# EAGLE design WaveformMorpher (EAGLE 8.3.1)

## Sheet 1 of 3
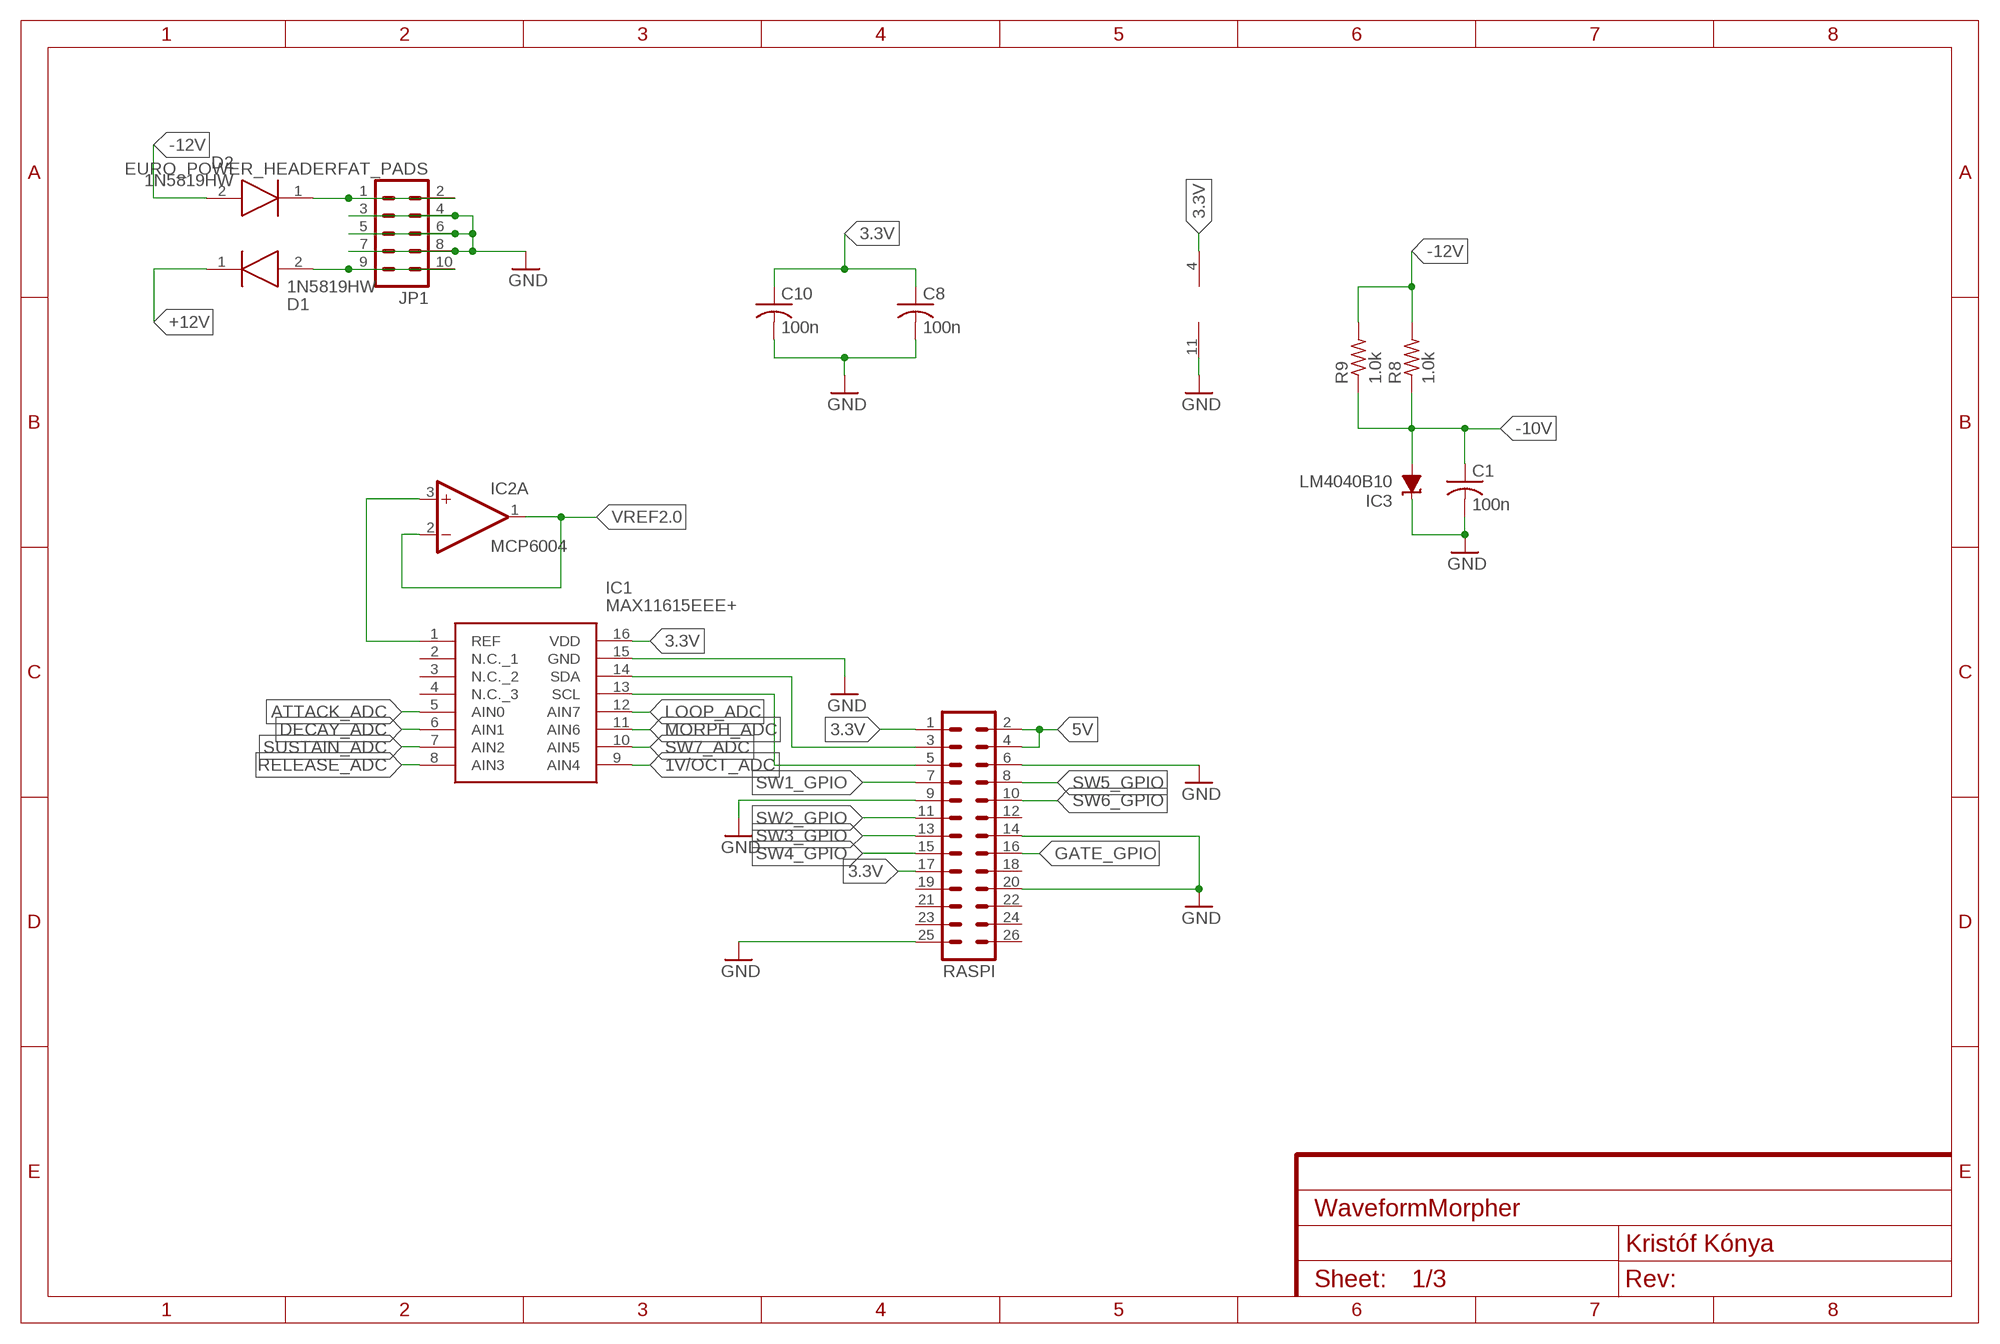
[diagram p0: schematic, sheet 1]
FRAME2 (FRAME-A4L): CNAME: POWER/DAC/CON; CREVISION: 0.7; DESIGNER: Kristóf Kónya; REV: 0.7

### Parts
C1  100n  C-USC0603  [C0603]
C8  100n  C-USC0603  [C0603]
C10  100n  C-USC0603  [C0603]
D1  1N5819HW  [SOD3716X145N]
D2  1N5819HW  [SOD3716X145N]
IC1  MAX11615EEE+  [SOP64P602X175-16N]
IC2  MCP6004  TL074D  [SO14]
IC3  LM4040B10  LM4041B12DBZ  [DBZ_R-PDSO-G3]
JP1  EURO_POWER_HEADERFAT_PADS  [EURO_PWR_HEADER_FAT]
R8  1.0k  R-US_R0603  [R0603]
R9  1.0k  R-US_R0603  [R0603]
RASPI  MA13-2  [MA13-2]

### Nets
1V/OCT_ADC: IC1.9(AIN4) ; also sheet 2
3.3V: C8.1 C10.1 IC1.16(VDD) IC2.4(P:V+) RASPI.1 RASPI.17 ; also sheet 2,3
5V: RASPI.2 RASPI.4 ; also sheet 2
+12V: D1.1(K) ; also sheet 2
-10V: C1.1 IC3.2(A) R8.1 R9.1 ; also sheet 2
-12V: D2.2(A) R8.2 R9.2 ; also sheet 2
ATTACK_ADC: IC1.5(AIN0) ; also sheet 3
DECAY_ADC: IC1.6(AIN1) ; also sheet 3
GATE_GPIO: RASPI.16 ; also sheet 2
GND: C1.2 C8.2 C10.2 IC1.15(GND) IC2.11(P:V-) IC3.1(C) JP1.3 JP1.4 JP1.5 JP1.6 JP1.7 JP1.8 RASPI.6 RASPI.9 RASPI.14 RASPI.20 RASPI.25 ; also sheet 2,3
LOOP_ADC: IC1.12(AIN7) ; also sheet 2
MORPH_ADC: IC1.11(AIN6) ; also sheet 2
N$1: IC1.14(SDA) RASPI.3
N$3: IC1.1(REF) IC2.3(A:+IN)
N$4: IC1.13(SCL) RASPI.5
N$7: D2.1(K) JP1.1 JP1.2
N$11: D1.2(A) JP1.9 JP1.10
RELEASE_ADC: IC1.8(AIN3) ; also sheet 3
SUSTAIN_ADC: IC1.7(AIN2) ; also sheet 3
SW1_GPIO: RASPI.7 ; also sheet 3
SW2_GPIO: RASPI.11 ; also sheet 3
SW3_GPIO: RASPI.13 ; also sheet 3
SW4_GPIO: RASPI.15 ; also sheet 3
SW5_GPIO: RASPI.8 ; also sheet 3
SW6_GPIO: RASPI.10 ; also sheet 3
SW7_ADC: IC1.10(AIN5) ; also sheet 3
VREF2.0: IC2.1(A:OUT) IC2.2(A:-IN) ; also sheet 2,3
Unconnected: IC1.2(N.C._1) IC1.3(N.C._2) IC1.4(N.C._3) RASPI.12 RASPI.18 RASPI.19 RASPI.21 RASPI.22 RASPI.23 RASPI.24 RASPI.26

## Sheet 2 of 3
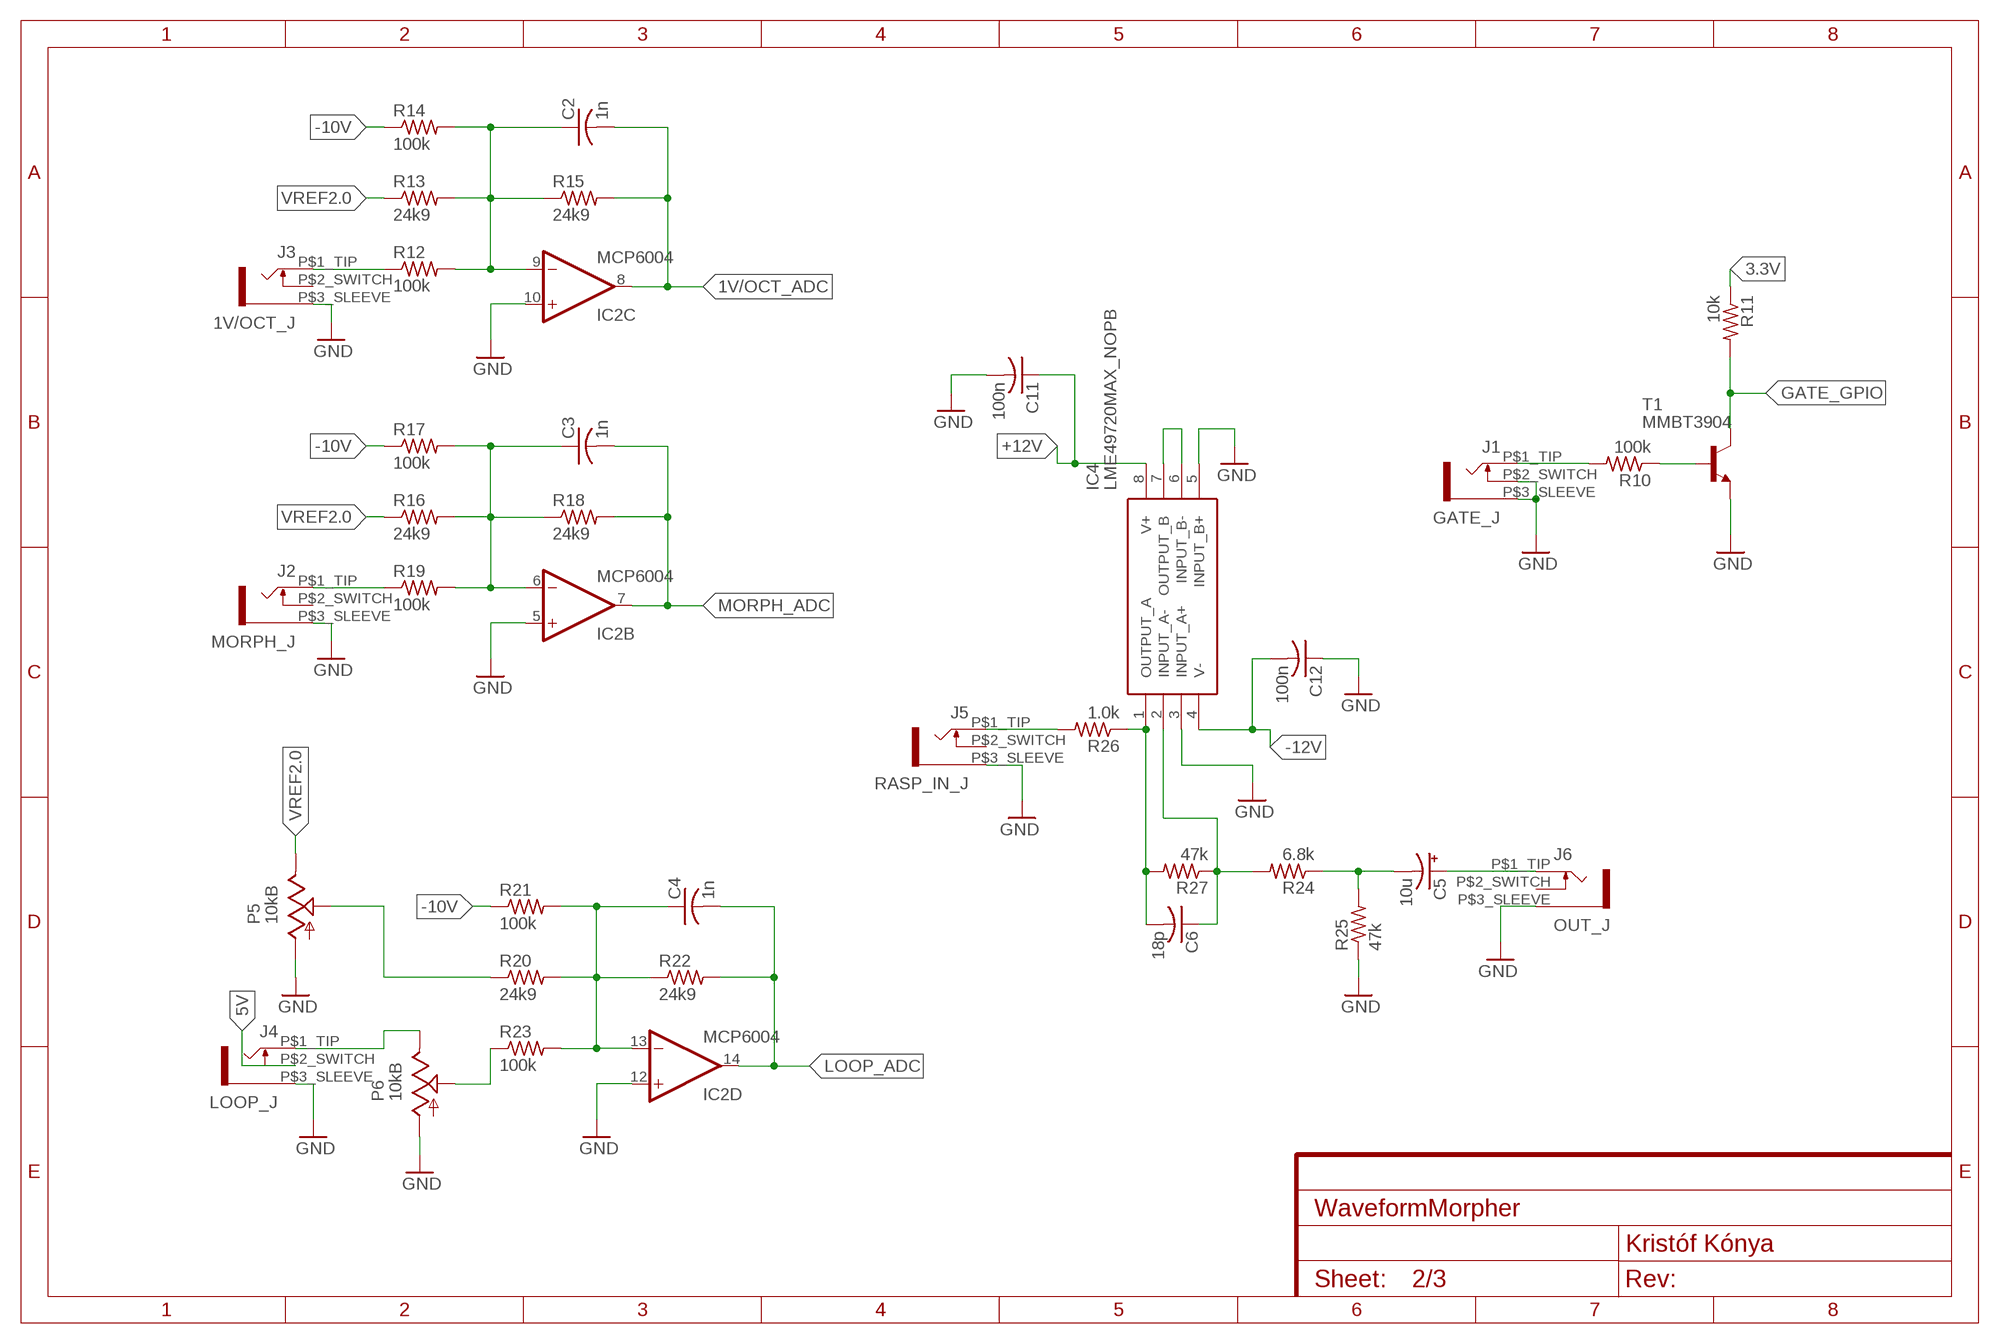
[diagram p1: schematic, sheet 2]
I/O (FRAME-A4L): CNAME: I/O; CREVISION: 0.7; DESIGNER: Kristóf Kónya; REV: 0.7

### Parts
C2  1n  C-USC0603  [C0603]
C3  1n  C-USC0603  [C0603]
C4  1n  C-USC0603  [C0603]
C5  10u  CPOL-USB  [PANASONIC_B]
C6  18p  C-USC0603  [C0603]
C11  100n  C-USC0603  [C0603]
C12  100n  C-USC0603  [C0603]
IC4  LME49720MAX_NOPB  [SOIC127P600X175-8N]
J1  GATE_J  WQP-PJ301M-12_JACK  [WQP-PJ301M-12_JACK]
J2  MORPH_J  WQP-PJ301M-12_JACK  [WQP-PJ301M-12_JACK]
J3  1V/OCT_J  WQP-PJ301M-12_JACK  [WQP-PJ301M-12_JACK]
J4  LOOP_J  WQP-PJ301M-12_JACK  [WQP-PJ301M-12_JACK]
J5  RASP_IN_J  WQP-PJ301M-12_JACK  [WQP-PJ301M-12_JACK]
J6  OUT_J  WQP-PJ301M-12_JACK  [WQP-PJ301M-12_JACK]
P5  10kB  9MM_SNAP-IN_POT_  [9MM_SNAP-IN_POT]
P6  10kB  9MM_SNAP-IN_POT_  [9MM_SNAP-IN_POT]
R10  100k  R-US_R0603  [R0603]
R11  10k  R-US_R0603  [R0603]
R12  100k  R-US_R0603  [R0603]
R13  24k9  R-US_R0603  [R0603]
R14  100k  R-US_R0603  [R0603]
R15  24k9  R-US_R0603  [R0603]
R16  24k9  R-US_R0603  [R0603]
R17  100k  R-US_R0603  [R0603]
R18  24k9  R-US_R0603  [R0603]
R19  100k  R-US_R0603  [R0603]
R20  24k9  R-US_R0603  [R0603]
R21  100k  R-US_R0603  [R0603]
R22  24k9  R-US_R0603  [R0603]
R23  100k  R-US_R0603  [R0603]
R24  6.8k  R-US_R0603  [R0603]
R25  47k  R-US_R0603  [R0603]
R26  1.0k  R-US_R0603  [R0603]
R27  47k  R-US_R0603  [R0603]
T1  MMBT3904  MMBT3904LT1-NPN-SOT23-BEC  [SOT23-BEC]

### Nets
1V/OCT_ADC: C2.2 IC2.8(C:OUT) R15.2 ; also sheet 1
3.3V: R11.1 ; also sheet 1,3
5V: J4.P$2_SWITCH ; also sheet 1
+12V: C11.1 IC4.8(V+) ; also sheet 1
-10V: R14.1 R17.1 R21.1 ; also sheet 1
-12V: C12.2 IC4.4(V-) ; also sheet 1
GATE_GPIO: R11.2 T1.C ; also sheet 1
GND: C11.2 C12.1 IC2.5(B:+IN) IC2.10(C:+IN) IC2.12(D:+IN) IC4.3(INPUT_A+) IC4.5(INPUT_B+) J1.P$2_SWITCH J1.P$3_SLEEVE J2.P$3_SLEEVE J3.P$3_SLEEVE J4.P$3_SLEEVE J5.P$3_SLEEVE J6.P$3_SLEEVE P5.1(A) P6.1(A) R25.1 T1.E ; also sheet 1,3
LOOP_ADC: C4.2 IC2.14(D:OUT) R22.2 ; also sheet 1
MORPH_ADC: C3.2 IC2.7(B:OUT) R18.2 ; also sheet 1
N$5: J1.P$1_TIP R10.2
N$6: R10.1 T1.B
N$8: J2.P$1_TIP R19.1
N$9: C2.1 IC2.9(C:-IN) R12.2 R13.2 R14.2 R15.1
N$10: C3.1 IC2.6(B:-IN) R16.2 R17.2 R18.1 R19.2
N$12: J3.P$1_TIP R12.1
N$14: C4.1 IC2.13(D:-IN) R20.2 R21.2 R22.1 R23.2
N$16: J4.P$1_TIP P6.3(E)
N$17: IC4.6(INPUT_B-) IC4.7(OUTPUT_B)
N$18: C6.2 IC4.1(OUTPUT_A) R26.1 R27.2
N$19: J5.P$1_TIP R26.2
N$20: C5.+ J6.P$1_TIP
N$21: C5.- R24.1 R25.2
N$22: P5.2(S) R20.1
N$23: C6.1 IC4.2(INPUT_A-) R24.2 R27.1
N$24: P6.2(S) R23.1
VREF2.0: P5.3(E) R13.1 R16.1 ; also sheet 1,3
Unconnected: J2.P$2_SWITCH J3.P$2_SWITCH J5.P$2_SWITCH J6.P$2_SWITCH

## Sheet 3 of 3
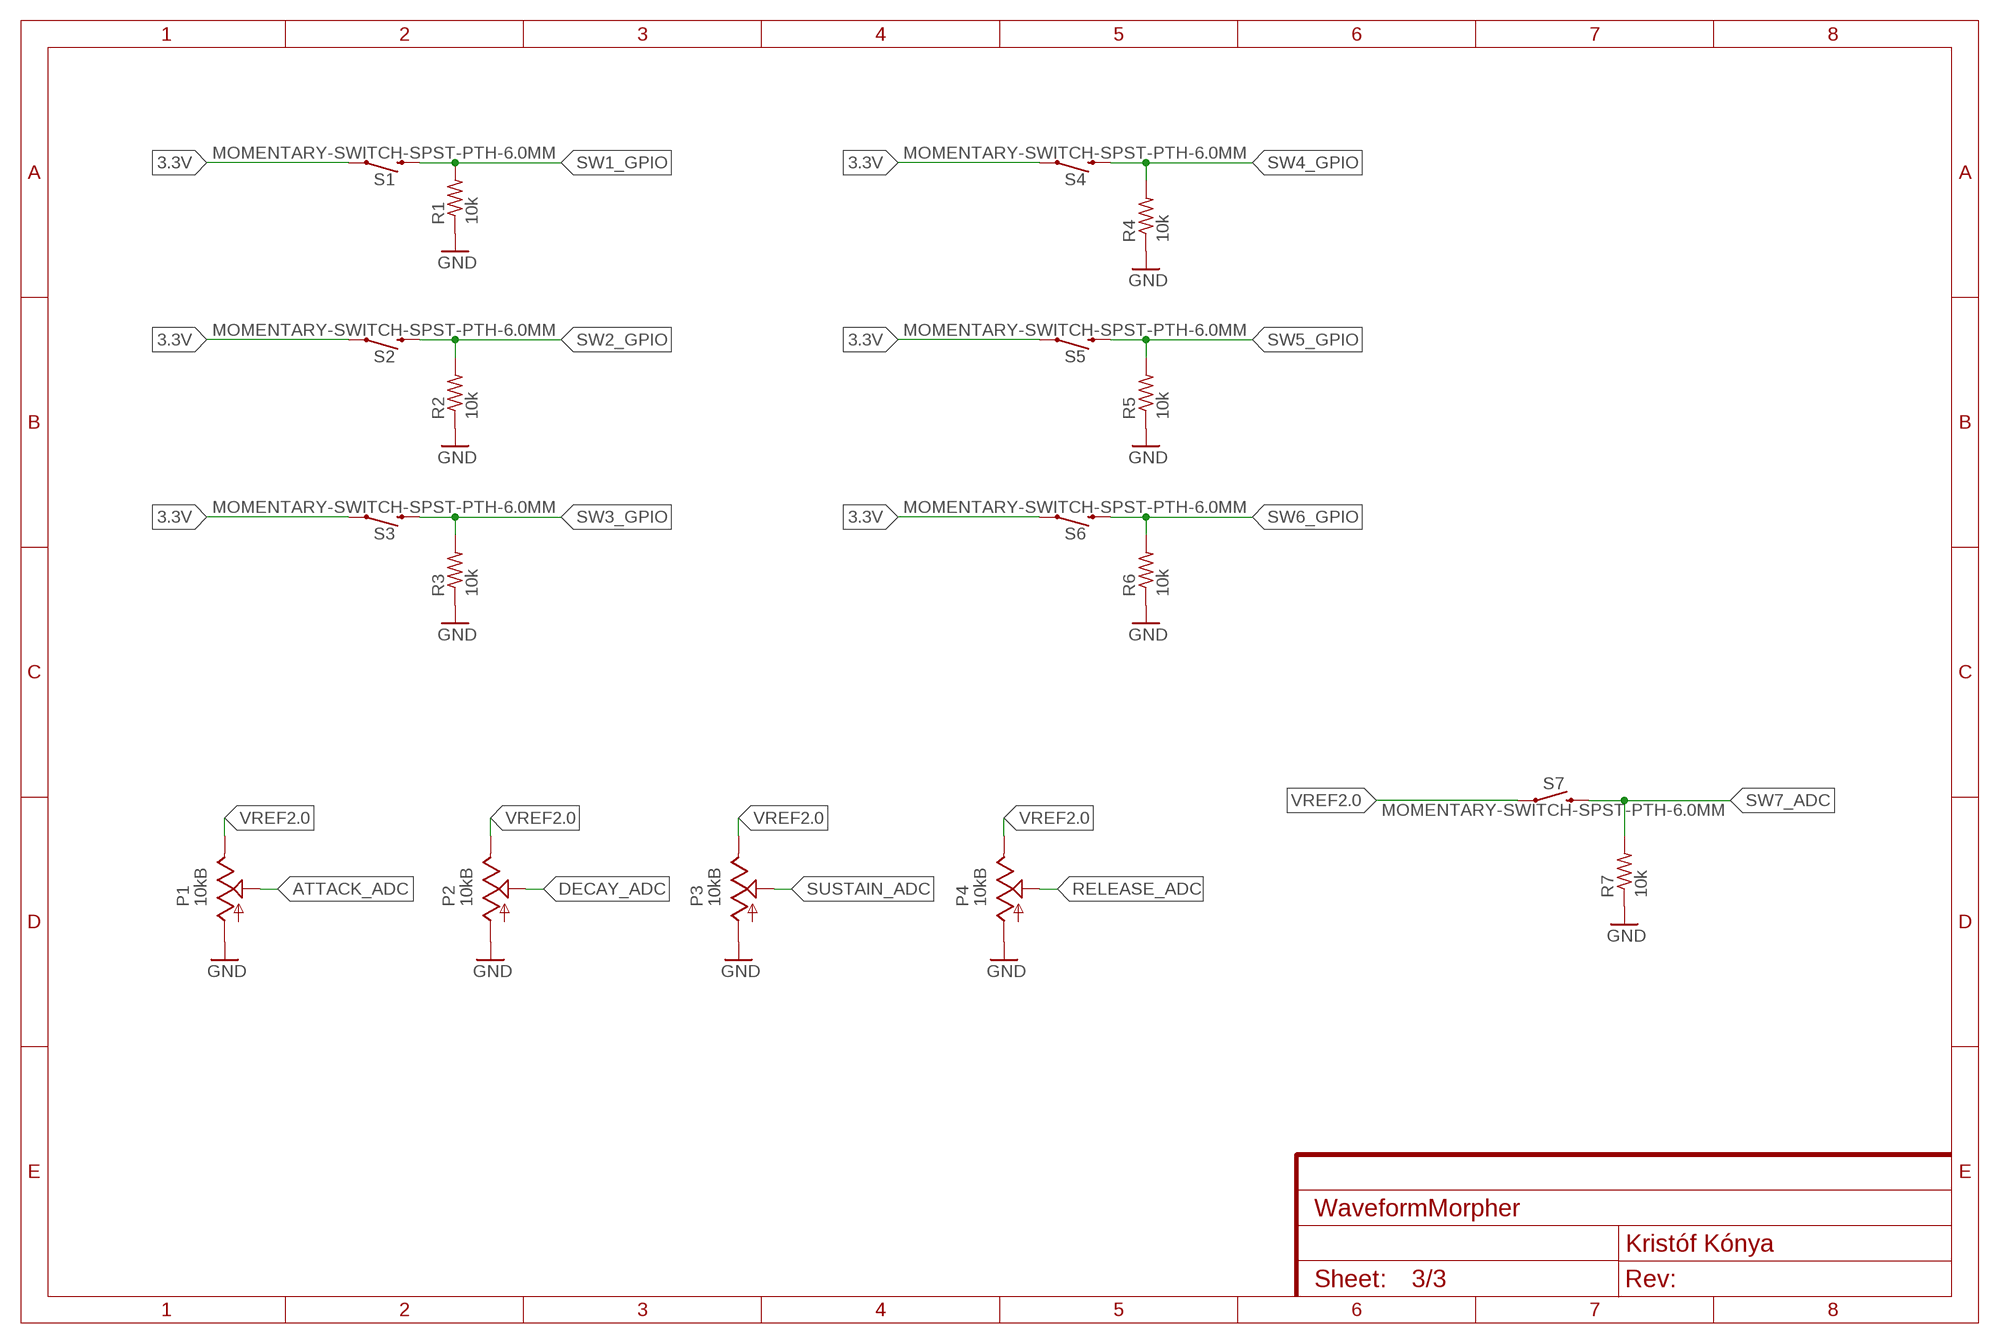
[diagram p2: schematic, sheet 3]
FRAME3 (FRAME-A4L): CNAME: SWITCHES/POTS; CREVISION: 0.7; DESIGNER: Kristóf Kónya; REV: 0.7

### Parts
P1  10kB  9MM_SNAP-IN_POT_  [9MM_SNAP-IN_POT]
P2  10kB  9MM_SNAP-IN_POT_  [9MM_SNAP-IN_POT]
P3  10kB  9MM_SNAP-IN_POT_  [9MM_SNAP-IN_POT]
P4  10kB  9MM_SNAP-IN_POT_  [9MM_SNAP-IN_POT]
R1  10k  R-US_R0603  [R0603]
R2  10k  R-US_R0603  [R0603]
R3  10k  R-US_R0603  [R0603]
R4  10k  R-US_R0603  [R0603]
R5  10k  R-US_R0603  [R0603]
R6  10k  R-US_R0603  [R0603]
R7  10k  R-US_R0603  [R0603]
S1  MOMENTARY-SWITCH-SPST-PTH-6.0MM  [TACTILE_SWITCH_PTH_6.0MM]
S2  MOMENTARY-SWITCH-SPST-PTH-6.0MM  [TACTILE_SWITCH_PTH_6.0MM]
S3  MOMENTARY-SWITCH-SPST-PTH-6.0MM  [TACTILE_SWITCH_PTH_6.0MM]
S4  MOMENTARY-SWITCH-SPST-PTH-6.0MM  [TACTILE_SWITCH_PTH_6.0MM]
S5  MOMENTARY-SWITCH-SPST-PTH-6.0MM  [TACTILE_SWITCH_PTH_6.0MM]
S6  MOMENTARY-SWITCH-SPST-PTH-6.0MM  [TACTILE_SWITCH_PTH_6.0MM]
S7  MOMENTARY-SWITCH-SPST-PTH-6.0MM  [TACTILE_SWITCH_PTH_6.0MM]

### Nets
3.3V: S1.1 S2.1 S3.1 S4.1 S5.1 S6.1 ; also sheet 1,2
ATTACK_ADC: P1.2(S) ; also sheet 1
DECAY_ADC: P2.2(S) ; also sheet 1
GND: P1.1(A) P2.1(A) P3.1(A) P4.1(A) R1.1 R2.1 R3.1 R4.1 R5.1 R6.1 R7.1 ; also sheet 1,2
RELEASE_ADC: P4.2(S) ; also sheet 1
SUSTAIN_ADC: P3.2(S) ; also sheet 1
SW1_GPIO: R1.2 S1.3 ; also sheet 1
SW2_GPIO: R2.2 S2.3 ; also sheet 1
SW3_GPIO: R3.2 S3.3 ; also sheet 1
SW4_GPIO: R4.2 S4.3 ; also sheet 1
SW5_GPIO: R5.2 S5.3 ; also sheet 1
SW6_GPIO: R6.2 S6.3 ; also sheet 1
SW7_ADC: R7.2 S7.3 ; also sheet 1
VREF2.0: P1.3(E) P2.3(E) P3.3(E) P4.3(E) S7.1 ; also sheet 1,2

## Library data of the parts
C1-C4 C6 C8 C10-C12 = rcl:C-US: CAPACITOR, American symbol
C5 = rcl:CPOL-US: POLARIZED CAPACITOR, American symbol
D1 D2 = SamacSys_Parts:1N5819HW: 1.0A SURFACE MOUNT SCHOTTKY BARRIER RECTIFIER Source: Datasheet <http://www.diodes.com/_files/datasheets/ds30217.pdf>; DESCRIPTION: 1.0A SURFACE MOUNT SCHOTTKY BARRIER RECTIFIER; HEIGHT: 1.45mm; MANUFACTURER_NAME: Diodes Inc.; MANUFACTURER_PART_NUMBER: 1N5819HW
IC1 = SamacSys_Parts:MAX11615EEE+: IC,ADC,MAX11615EEE+ Maxim MAX11615EEE+, 12 bit Parallel ADC, 8-channel Differential Input, 16-Pin QSOP Source: Datasheet <https://componentsearchengine.com/Datasheets/1/MAX11615EEE .pdf>; DESCRIPTION: IC,ADC,MAX11615EEE+ Maxim MAX11615EEE+, 12 bit Parallel ADC, 8-channel Differential Input, 16-Pin QSOP; HEIGHT: 1.75mm; MANUFACTURER_NAME: Maxim Integrated; MANUFACTURER_PART_NUMBER: MAX11615EEE+; MOUSER_PART_NUMBER: 700-MAX11615EEE; MOUSER_PRICE-STOCK: https://www.mouser.com/Search/Refine.aspx?Keyword=700-MAX11615EEE
IC2 = gm-ics:TL074: OP AMP
IC3 = texas:LM4041: PRECISION MICROPOWER SHUNT VOLTAGE REFERENCE Source: http://focus.ti.com/lit/ds/slcs146e/slcs146e.pdf; MPN: LM4041B12IDBZR; OC_FARNELL: 1575212; OC_NEWARK: 58K5882
IC4 = SamacSys_Parts:LME49720MAX_NOPB: Dual High Performance, High Fidelity Audio Operational Amplifier Source: Datasheet <http://www.ti.com/lit/gpn/lme49720>; DESCRIPTION: Dual High Performance, High Fidelity Audio Operational Amplifier; HEIGHT: 1.75mm; MANUFACTURER_NAME: Texas Instruments; MANUFACTURER_PART_NUMBER: LME49720MAX/NOPB; MOUSER_PART_NUMBER: 926-LME49720MAX/NOPB; MOUSER_PRICE-STOCK: https://www.mouser.com/Search/Refine.aspx?Keyword=926-LME49720MAX%2FNOPB
J1-J6 = MusicThingModular:WQP-PJ301M-12_JACK
JP1 = MusicThingModular:EURO_POWER_HEADER: Power Header 10 pin power header for Eurorack Power Supplies Variants with fatter pads for easier soldering, and the LOCK variant which has 5mil offset pins to hold the component in place before soldering
P1-P6 = MusicThingModular:9MM_SNAP-IN_POT: 9mm vertical snap-in pot, Alpha / Panasonic style
R1-R27 = rcl:R-US_: RESISTOR, American symbol
RASPI = con-lstb:MA13-2: PIN HEADER; OC_FARNELL: unknown; OC_NEWARK: unknown
S1-S7 = SparkFun-Switches:MOMENTARY-SWITCH-SPST: Momentary Switch (Pushbutton) - SPST Normally-open (NO) SPST momentary switches (buttons, pushbuttons). Variants PTH-12MM - 12mm square, through-hole Momentary Pushbutton Switch - 12mm Square <https://www.sparkfun.com/products/9190> (COM-09190) PTH-6.0MM, PTH-6.0MM-KIT - 6.0mm square, through-hole Mini Pushbutton Switch <https://www.sparkfun.com/products/97> (COM-00097) KIT package intended for soldering kit's - only one side of pads' copper is exposed. PTH-RIGHT-ANGLE-KIT - Right-angle, through-hole Right Angle Tactile Button <https://www.sparkfun.com/products/10791> - Used on SparkFun BigTime Watch Kit <https://www.sparkfun.com/products/11734> SMD-12MM - 12mm square, surface-mount Tactile Button - SMD (12mm) <https://www.sparkfun.com/products/12993> (COM-12993) Used on SparkFun PicoBoard <https://www.sparkfun.com/products/11888> SMD-4.5MM - 4.5mm Square Trackball Switch Used on SparkFun Blackberry Trackballer Breakout <https://www.sparkfun.com/products/13169> SMD-4.6MMX2.8MM - 4.60mm x 2.80mm, surface mount Used on SparkFun SAMD21 Mini Breakout <https://www.sparkfun.com/products/13664> SMD-5.2MM, SMD-5.2-REDUNDANT - 5.2mm square, surface-mount Mini Pushbutton Switch - SMD <https://www.sparkfun.com/products/8720> (COM-08720) Used on Arduino Pro Mini <https://www.sparkfun.com/products/11114> REDUNDANT package connects both switch circuits together SMD-6.0X3.5MM - 6.0 x 3.5mm, surface mount Momentary Reset Switch SMD <https://www.sparkfun.com/products/8229> (COM-08229) SMD-6.2MM-TALL - 6.2mm square, surface mount Tactile Button - SMD (6mm) <https://www.sparkfun.com/products/12992> Used on SparkFun Digital Sandbox <https://www.sparkfun.com/products/12651> SMD-RIGHT-ANGLE - Right-angle, surface mount Used on SparkFun Block for Intel® Edison - Arduino <https://www.sparkfun.com/products/13036>; PROD_ID: SWCH-08441; SF_SKU: COM-00097
T1 = transistor:*-NPN-: NPN Transistror BF959 corrected 2008.03.06

## Board
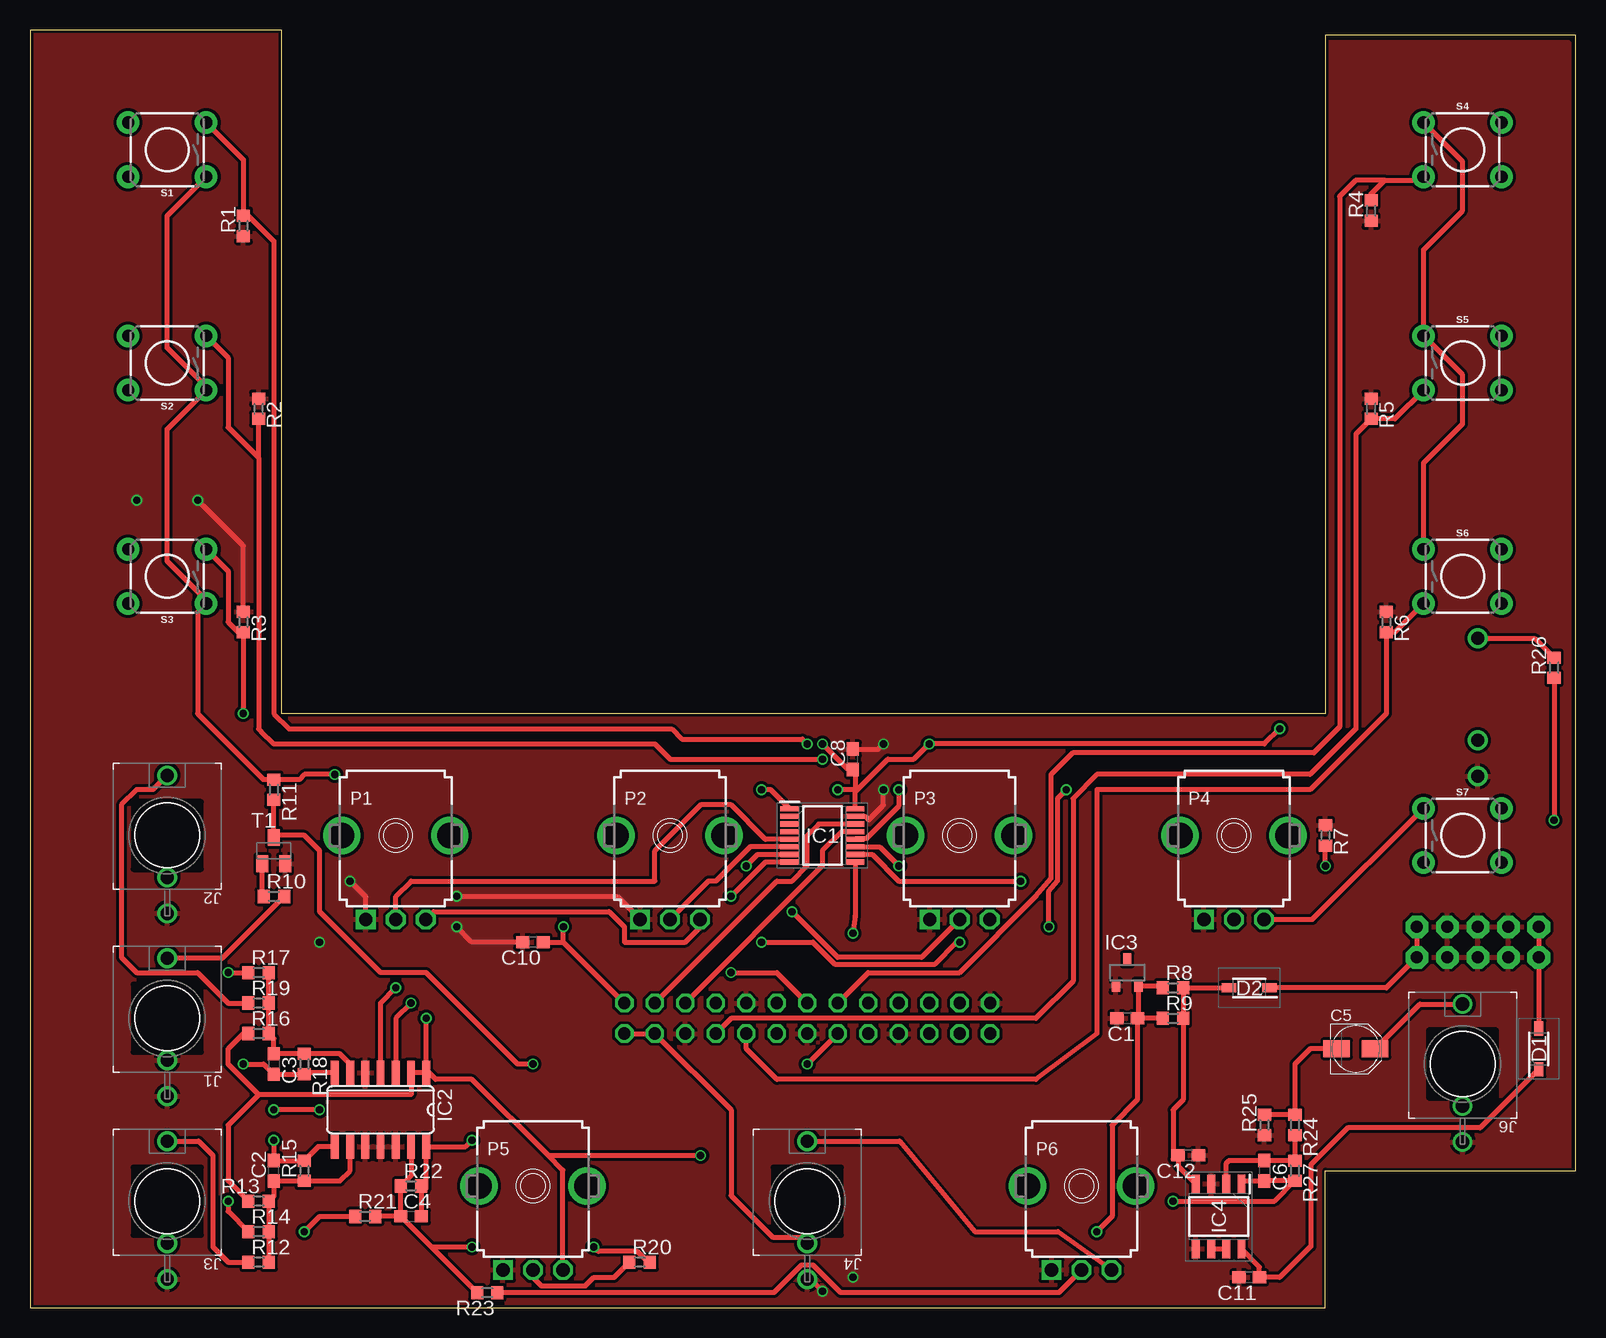
[diagram p3: board, top side]
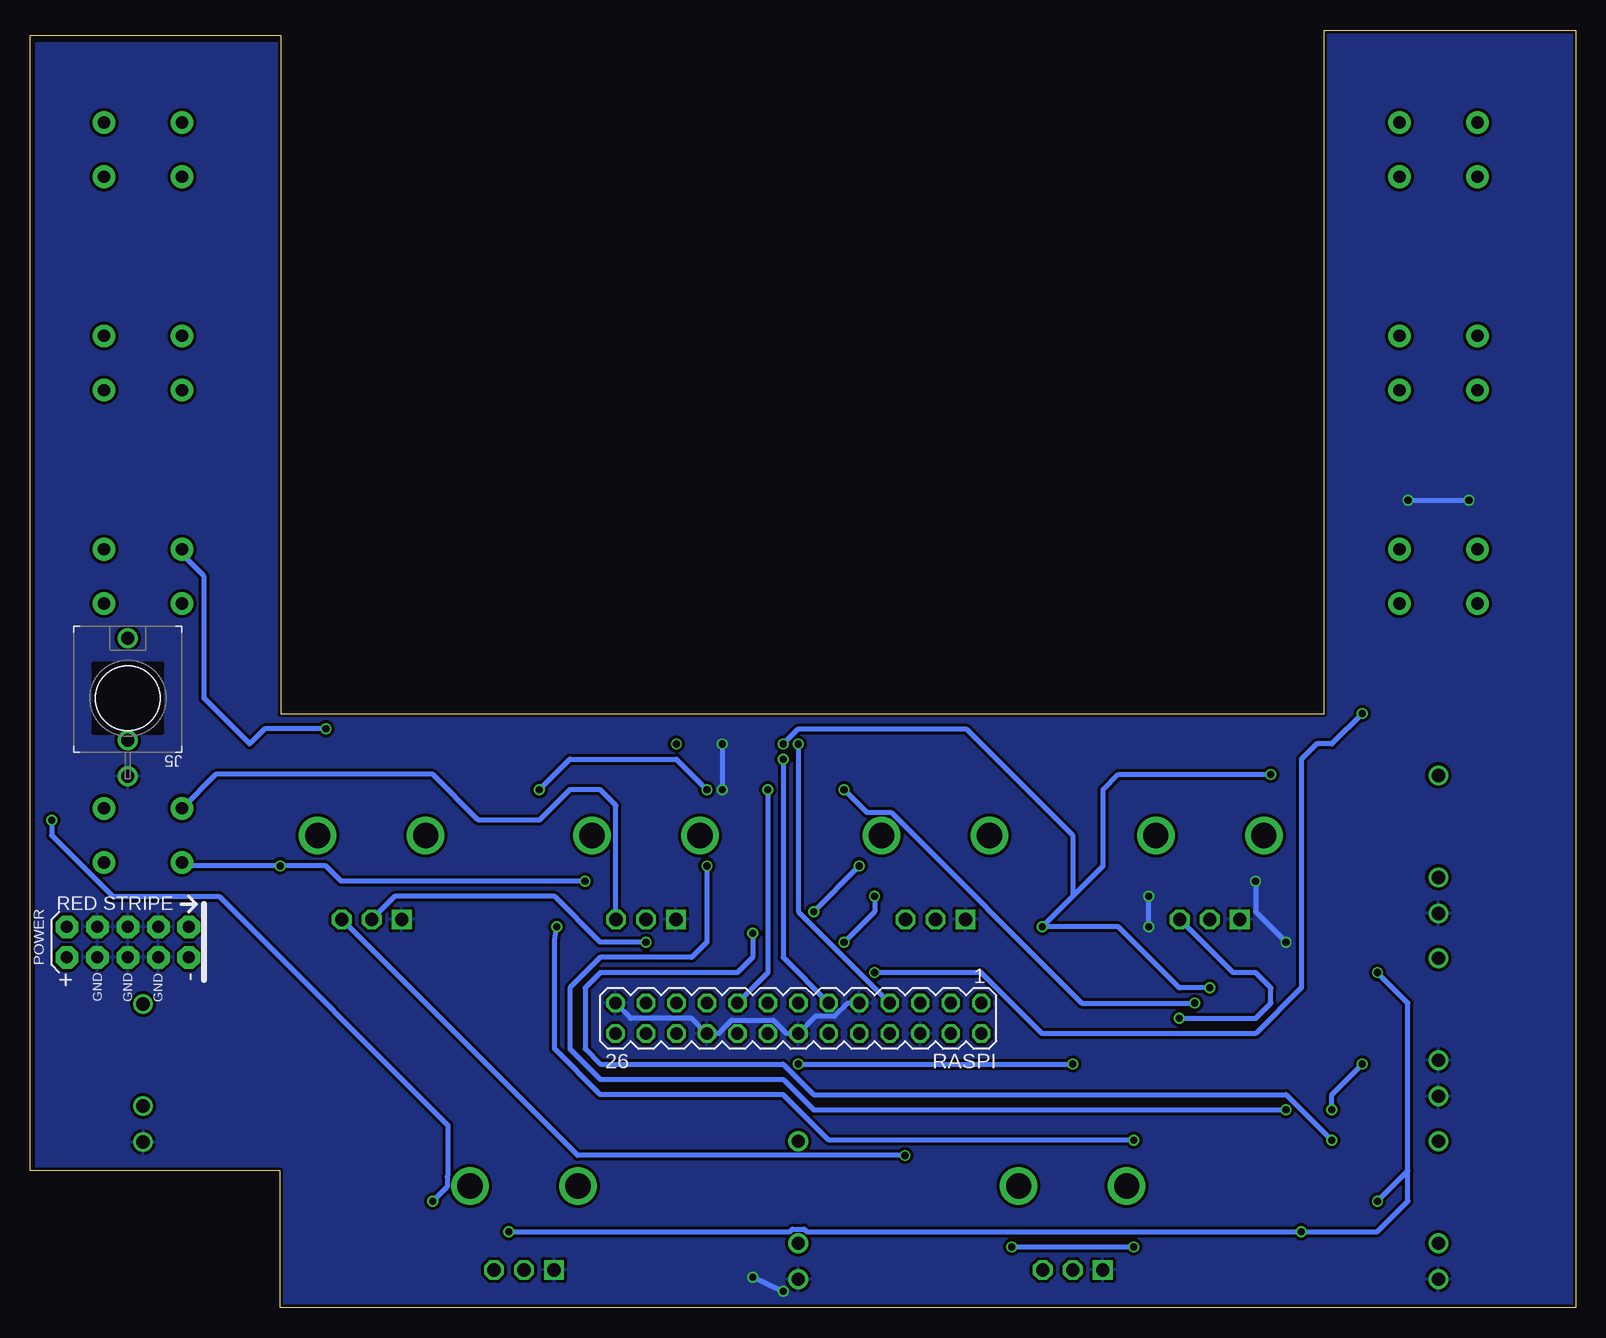
[diagram p4: board, bottom side, seen from below]

Size 128.8 x 106.49 mm. Coordinates in mm from the lower left corner, seen from the top.
Outline: 0,0 107.95,0 107.95,11.43 128.8,11.43 128.8,106.05 107.92,106.05 107.92,49.49 20.96,49.49 20.96,106.49 0,106.49 0,0
Copper layers (1*16): Top 0.035559375mm / dielectric 1.6mm / Bottom 0.035559375mm
Design rules "jlcpcb2layer": minimum track width 5mil, minimum drill 12mil, track to track 5mil, track to pad 5mil, pad to pad 5mil, via to via 5mil, smd to smd 5mil, copper to edge 8mil, drill to drill 6mil, minimum pad ring 5mil, minimum via ring 3mil, stop-mask expansion 2.5mil, vias tented up to drill 0mil, thermal gap 10mil

### Footprints (pad centres in the part's own frame; a part is rotated, then mirrored left to right if it is on the bottom)
C0603 = smd 1.1 x 1: 1 -0.85,0; 2 0.85,0
PANASONIC_B = smd 2.2 x 1.4: + 1.6,0; - -1.6,0
SOD3716X145N = smd 1.2 x 0.75: 1 -1.7,0; 2 1.7,0
SOP64P602X175-16N = smd 1.55 x 0.435: 1 -2.725,2.222; 2 -2.725,1.588; 3 -2.725,0.952; 4 -2.725,0.318; 5 -2.725,-0.318; 6 -2.725,-0.952; 7 -2.725,-1.588; 8 -2.725,-2.222; 9 2.725,-2.222; 10 2.725,-1.588; 11 2.725,-0.952; 12 2.725,-0.318; 13 2.725,0.318; 14 2.725,0.952; 15 2.725,1.588; 16 2.725,2.222
SO14 = smd 0.66 x 2.032: 1 -3.81,-3.073; 2 -2.54,-3.073; 3 -1.27,-3.073; 4 0,-3.073; 5 1.27,-3.073; 6 2.54,-3.073; 7 3.81,-3.073; 8 3.81,3.073; 9 2.54,3.073; 10 1.27,3.073; 11 0,3.073; 12 -1.27,3.073; 13 -2.54,3.073; 14 -3.81,3.073
DBZ_R-PDSO-G3 = smd 0.7 x 1: 1 -0.95,-1.1; 2 0.95,-1.1; 3 0,1.1
SOIC127P600X175-8N = smd 1.528 x 0.65: 1 -2.711,1.905; 2 -2.711,0.635; 3 -2.711,-0.635; 4 -2.711,-1.905; 5 2.711,-1.905; 6 2.711,-0.635; 7 2.711,0.635; 8 2.711,1.905
WQP-PJ301M-12_JACK = drill 1.1: P$1_TIP 0,5; P$2_SWITCH 0,-3.5; P$3_SLEEVE 0,-6.5
EURO_PWR_HEADER_FAT = drill 1.016 pad 1.88 octagon: 1 -5.08,-1.27; 2 -5.08,1.27; 3 -2.54,-1.27; 4 -2.54,1.27; 5 0,-1.27; 6 0,1.27; 7 2.54,-1.27; 8 2.54,1.27; 9 5.08,-1.27; 10 5.08,1.27
9MM_SNAP-IN_POT = drill 1.1 square: 1 -2.5,-7 | drill 1.1 octagon: 2 0,-7; 3 2.5,-7 | drill 2.1 pad 2.794: CHASSIS1 -4.5,0; CHASSIS2 4.5,0
R0603 = smd 1 x 1.1: 1 -0.85,0; 2 0.85,0
MA13-2 = drill 1.016 octagon: 1 -15.24,-1.27; 2 -15.24,1.27; 3 -12.7,-1.27; 4 -12.7,1.27; 5 -10.16,-1.27; 6 -10.16,1.27; 7 -7.62,-1.27; 8 -7.62,1.27; 9 -5.08,-1.27; 10 -5.08,1.27; 11 -2.54,-1.27; 12 -2.54,1.27; 13 0,-1.27; 14 0,1.27; 15 2.54,-1.27; 16 2.54,1.27; 17 5.08,-1.27; 18 5.08,1.27; 19 7.62,-1.27; 20 7.62,1.27; 21 10.16,-1.27; 22 10.16,1.27; 23 12.7,-1.27; 24 12.7,1.27; 25 15.24,-1.27; 26 15.24,1.27
TACTILE_SWITCH_PTH_6.0MM = drill 1.016 pad 1.88: 1 -3.251,2.261; 2 3.251,2.261; 3 -3.251,-2.261; 4 3.251,-2.261
SOT23-BEC = smd 1 x 1.4: B -0.95,-1.1; C 0,1.1; E 0.95,-1.1

### Placement (x,y rotation side)
C1  91.44,24.13 180 top
C2  20.32,11.43 90 top
C3  20.32,20.32 270 top
C4  31.75,7.62 0 top
C5  110.49,21.59 0 top
C6  102.87,11.43 270 top
C8  68.58,45.72 90 top
C10  41.91,30.48 180 top
C11  101.6,2.54 180 top
C12  96.52,12.7 180 top
D1  125.73,21.59 90 top
D2  101.6,26.67 180 top
IC1  66.04,39.37 0 top
IC2  29.21,16.51 180 top
IC3  91.44,27.94 0 top
IC4  99.06,7.62 270 top
J1  11.43,24.13 0 top
J2  11.43,39.37 0 top
J3  11.43,8.89 0 top
J4  64.77,8.89 0 top
J5  120.65,50.8 0 bottom
J6  119.38,20.32 0 top
JP1  120.65,30.48 180 bottom
P1  30.48,39.37 0 top
P2  53.34,39.37 0 top
P3  77.47,39.37 0 top
P4  100.33,39.37 0 top
P5  41.91,10.16 0 top
P6  87.63,10.16 0 top
R1  17.78,90.17 90 top
R2  19.05,74.93 270 top
R3  17.78,57.15 270 top
R4  111.76,91.44 90 top
R5  111.76,74.93 270 top
R6  113.03,57.15 270 top
R7  107.95,39.37 270 top
R8  95.25,26.67 0 top
R9  95.25,24.13 0 top
R10  20.32,34.29 0 top
R11  20.32,43.18 270 top
R12  19.05,3.81 0 top
R13  19.05,8.89 0 top
R14  19.05,6.35 0 top
R15  22.86,11.43 90 top
R16  19.05,22.86 0 top
R17  19.05,27.94 0 top
R18  22.86,20.32 270 top
R19  19.05,25.4 0 top
R20  50.8,3.81 0 top
R21  27.94,7.62 0 top
R22  31.75,10.16 0 top
R23  38.1,1.27 180 top
R24  105.41,15.24 270 top
R25  102.87,15.24 90 top
R26  127,53.34 90 top
R27  105.41,11.43 270 top
RASPI  64.77,24.13 180 bottom
S1  11.43,96.52 180 top
S2  11.43,78.74 180 top
S3  11.43,60.96 180 top
S4  119.38,96.52 0 top
S5  119.38,78.74 0 top
S6  119.38,60.96 0 top
S7  119.38,39.37 0 top
T1  20.32,38.1 0 top

### Tracks (layer width: path | path; a pad name or v marks a point on that pad's centre or on a via)
1V/OCT_ADC  (via drill 0.6)
  Top 0.406: IC2.8 24.02,13.44 R15.2 C2.2 v20.32,13.97 | IC1.9 68.77,32.67 v68.58,31.21
  Bottom 0.406: v68.58,31.21 68.58,29.21 69.85,27.94 81.28,27.94 82.55,26.67 82.55,21.59 81.28,20.32 66.04,20.32 63.5,17.78 24.13,17.78 v20.32,13.97
3.3V  (via drill 0.6)
  Top 0.406: S1.1 11.43,91.01 11.43,80.01 14.68,76.76 S2.1 11.43,73.23 11.43,62.23 14.68,58.98 S3.1 13.97,57.99 13.97,49.53 19.47,44.03 R11.1 22.44,44.03 22.86,44.45 v25.4,44.45 | S6.1 116.13,70.41 119.38,73.66 119.38,77.75 S5.1 116.13,88.19 119.38,91.44 119.38,95.53 S4.1 | IC1.16 68.77,42.99 | 68.77,42.99 68.58,43.18 v67.31,43.18 | 44.45,30.48 RASPI.1 | 44.45,30.48 v44.45,31.75 | 68.77,42.99 71.49,45.72 73.66,45.72 v74.93,46.99 102.87,46.99 v104.14,48.26 | C10.1 44.45,30.48 | 68.77,42.99 68.77,44.69 C8.1 68.16,44.87 v66.04,46.99 | IC2.4 29.21,25.4 v30.48,26.67
  Bottom 0.406: RASPI.17 67.31,27.94 v67.31,43.18 | 41.91,34.29 v44.45,31.75 38.1,31.75 33.02,26.67 v30.48,26.67 | 41.91,34.29 39.37,36.83 39.37,43.18 38.1,44.45 v25.4,44.45 | S6.1 116.13,62.79 114.3,60.96 114.3,50.8 110.49,46.99 109.22,48.26 v104.14,48.26 | v66.04,46.99 64.77,48.26 50.8,48.26 41.91,39.37 41.91,34.29
5V
  Top 0.406: RASPI.2 RASPI.4 58.42,16.51 58.42,9.35 61.89,5.89 64.27,5.89 J4.P$2_SWITCH
+12V
  Top 0.406: IC4.8 102.45,3.42 C11.1 104.14,2.54 106.73,5.13 106.73,11.94 109.8,15 120.84,15 D1.1
-10V  (via drill 0.6)
  Top 0.406: v22.86,6.35 24.13,7.62 R21.1 | v16.51,27.94 R17.1 | v16.51,8.89 16.51,8.04 R14.1 | 92.29,23.91 C1.1 R9.1 | 92.29,23.91 92.29,17.36 90.17,15.24 90.17,7.62 v88.9,6.35 | 92.29,23.91 92.39,24.02 IC3.2 94.23,26.84 R8.1
  Bottom 0.406: v88.9,6.35 65.48,6.35 65.26,6.57 64.28,6.57 64.06,6.35 v22.86,6.35 16.51,6.35 13.97,8.89 13.97,11.43 | 13.97,11.43 13.97,25.4 v16.51,27.94 | 13.97,11.43 v16.51,8.89
-12V
  Top 0.406: 95.67,12.43 C12.2 | 95.67,12.43 95.67,11.82 IC4.4 | D2.2 R8.2 R9.2 96.1,17.36 95.25,16.51 95.25,12.43 95.67,12.43
ATTACK_ADC
  Top 0.406: P1.2 30.48,34.29 31.75,35.56 52.07,35.56 52.07,38.1 55.88,41.91 58.42,41.91 61.28,39.05 IC1.5
DECAY_ADC
  Top 0.406: IC1.6 60.01,38.42 57.15,35.56 56.53,35.56 P2.2
GATE_GPIO  (via drill 0.6)
  Top 0.406: R11.2 T1.C 20.49,39.37 22.86,39.37 24.13,38.1 24.13,33.02 29.21,27.94 33.02,27.94 40.64,20.32 v41.91,20.32 | RASPI.16 v64.77,20.32
  Bottom 0.406: v64.77,20.32 v41.91,20.32
GND  (via drill 0.6)
  Top 0.406: R3.1 17.78,63.5 v13.97,67.31 | P1.1 27.98,34.25 v26.67,35.56 | J4.P$3_SLEEVE 65.04,2.39 v66.04,1.39 | C8.2 70.7,46.57 v71.12,46.99 | C10.2 36.83,30.48 v35.56,31.75 | v35.56,34.29 48.92,34.29 P2.1 | IC1.15 69.59,40.96 69.87,40.68 69.87,40.64 71.12,41.89 v71.12,43.18
  Bottom 0.406: v13.97,67.31 v8.89,67.31 | v26.67,35.56 26.67,33.02 v24.13,30.48 | v66.04,1.39 66.16,1.39 v68.58,2.54 | RASPI.9 60.65,25.4 61.77,24.28 63.35,24.28 RASPI.14 65.73,22.86 66.85,23.98 70.31,23.98 71.43,22.86 RASPI.20 73.66,24.13 78.74,24.13 RASPI.25 | v71.12,46.99 v71.12,43.18 | v35.56,31.75 v35.56,34.29
  pour Top (isolate 0.254): 0,106.68 0,0 107.95,0 107.95,11.43 128.27,11.43 128.27,105.41 107.95,105.41 107.95,49.53 21.59,49.53 21.59,106.68
  pour Bottom (isolate 0.254): 0,106.68 0,0 107.95,0 107.95,11.43 128.27,11.43 128.27,105.41 107.95,105.41 107.95,49.53 21.59,49.53 21.59,106.68
LOOP_ADC  (via drill 0.6)
  Top 0.406: 32.6,9.94 C4.2 | 32.6,9.94 R22.2 | 32.6,9.94 33.02,9.94 IC2.14 36.3,13.44 v36.83,13.97 | 86.19,43.01 v86.36,43.18 85.64,42.46 85.64,35.58 84.92,34.73 v84.92,31.75 | IC1.12 68.83,39.12 69.69,39.12 72.39,41.82 v72.39,43.18
  Bottom 0.406: v36.83,13.97 62.23,13.97 66.04,17.78 81.28,17.78 85.09,21.59 85.09,30.66 v84.92,31.75 | v86.36,43.18 83.82,45.72 74.93,45.72 v72.39,43.18
MORPH_ADC  (via drill 0.6)
  Top 0.406: IC2.7 22.97,19.58 R18.2 C3.2 19.47,20.32 v17.78,20.32 | IC1.11 70.8,38.42 v72.39,36.83 | v24.13,16.51 v20.32,16.51
  Bottom 0.406: v72.39,36.83 72.39,30.48 73.66,29.21 81.28,29.21 83.82,26.67 83.82,21.59 81.28,19.05 66.04,19.05 63.5,16.51 v24.13,16.51 | v20.32,16.51 20.32,17.78 v17.78,20.32
N$1
  Top 0.406: IC1.14 65.72,40.32 64.77,39.37 64.77,36.83 63.5,35.56 62.23,35.56 RASPI.3
N$3  (via drill 0.6)
  Top 0.406: IC1.1 61.73,43.18 v60.96,43.18 | v31.75,25.4 30.48,24.13 IC2.3
  Bottom 0.406: v60.96,43.18 59.06,41.28 57.05,41.28 41.16,25.4 v31.75,25.4
N$4
  Top 0.406: IC1.13 67.63,39.69 66.04,38.1 66.04,36.83 RASPI.5
N$5
  Top 0.406: R10.2 16.01,29.13 J1.P$1_TIP
N$6
  Top 0.406: R10.1 19.37,34.39 T1.B
N$7
  Top 0.406: JP1.1 JP1.2 113.03,26.67 D2.1
N$8
  Top 0.406: J2.P$1_TIP 10.24,43.18 8.89,43.18 7.62,41.91 7.62,29.21 8.89,27.94 13.97,27.94 16.51,25.4 R19.1
N$9
  Top 0.406: R12.2 R14.2 R13.2 20.32,9.31 C2.1 R15.1 25.82,10.58 26.67,11.43 IC2.9
N$10
  Top 0.406: R17.2 R19.2 R16.2 20.32,22.44 C3.1 R18.1 25.82,21.17 26.67,20.32 IC2.6
N$11
  Top 0.406: JP1.9 JP1.10 D1.2
N$12
  Top 0.406: J3.P$1_TIP 14.05,13.89 15.24,12.7 15.24,5.08 16.51,3.81 R12.1
N$14  (via drill 0.6)
  Top 0.406: IC2.13 31.75,11.01 R22.1 C4.1 | C4.1 R21.2 | R20.2 51.5,3.81 50.6,4.72 47.35,4.72 v46.99,5.08 | 33.44,5.08 v36.83,5.08 | 33.44,5.08 C4.1 | R23.2 33.44,5.08
  Bottom 0.406: v46.99,5.08 v36.83,5.08
N$16
  Top 0.406: J4.P$1_TIP 72.47,13.89 78.74,6.35 85.67,6.35 P6.3
N$17
  Top 0.406: IC4.6 IC4.7
N$18  (via drill 0.6)
  Top 0.406: IC4.1 100.97,10.58 C6.2 R27.2 103.72,8.89 v95.25,8.89 | R26.1 v127,40.64
  Bottom 0.406: v127,40.64 127,39.37 121.92,34.29 113.03,34.29 93.98,15.24 93.98,11.02 94.04,10.95 94.04,10.1 v95.25,8.89
N$19
  Top 0.406: J5.P$1_TIP 125.39,55.8 R26.2
N$20
  Top 0.406: C5.+ 115.82,25.32 J6.P$1_TIP
N$21
  Top 0.406: R25.2 R24.1 105.41,20.32 106.68,21.59 C5.-
N$22
  Top 0.406: 41.91,3.81 P5.2 41.91,2.54 42.62,1.83 46.28,1.83 46.99,2.54 48.68,2.54 R20.1
N$23
  Top 0.406: R24.2 R27.1 C6.1 99.91,12.28 99.69,12.06 IC4.2
N$24
  Top 0.406: P6.2 85.74,1.27 67.56,1.27 65.26,3.57 64.28,3.57 61.98,1.27 R23.1
RELEASE_ADC  (via drill 0.6)
  Top 0.406: IC1.8 61.28,37.15 v58.42,34.29 | v60.96,30.48 65.25,30.48 67.08,28.65 75.42,28.65 77.25,30.48 v77.47,30.48
  Bottom 0.406: v58.42,34.29 58.42,33.02 v60.96,30.48 | v77.47,30.48 81.28,30.48 85.09,34.29 98.41,34.29 P4.2
SUSTAIN_ADC  (via drill 0.6)
  Top 0.406: v59.69,36.83 60.64,37.78 IC1.7 | P3.2 74.31,29.21 67.31,29.21 v63.5,33.02
  Bottom 0.406: v63.5,33.02 v59.69,36.83
SW1_GPIO  (via drill 0.6)
  Top 0.406: S1.3 17.78,95.68 R1.2 18.2,91.02 20.32,88.9 20.32,49.53 21.59,48.26 53.48,48.26 54.33,47.4 64.36,47.4 v64.77,46.99
  Bottom 0.406: v64.77,46.99 64.77,33.02 RASPI.7
SW2_GPIO  (via drill 0.6)
  Top 0.406: S2.3 16.51,79.17 16.51,73.37 19.05,70.83 | v66.04,45.72 53.34,45.72 52.07,46.99 20.32,46.99 19.24,48.07 19.05,48.26 19.05,70.83 | 19.05,70.83 R2.2
  Bottom 0.406: v66.04,45.72 66.04,29.21 RASPI.11
SW3_GPIO  (via drill 0.6)
  Top 0.406: S3.3 16.51,61.39 16.51,57.15 17.36,56.3 R3.2 v17.78,49.53 | v58.42,27.94 62.23,27.94 RASPI.13
  Bottom 0.406: v17.78,49.53 20.32,46.99 21.59,46.99 22.86,45.72 22.86,26.67 26.67,22.86 44.45,22.86 49.53,27.94 v58.42,27.94
SW4_GPIO
  Top 0.406: RASPI.15 69.85,27.94 77.47,27.94 83.82,34.29 85.09,35.78 85.09,44.45 86.9,46.26 106.98,46.26 109.14,48.41 109.14,92.63 110.49,93.98 112.89,93.98 | 112.89,93.98 115.85,93.98 S4.3 | R4.2 111.76,92.84 112.89,93.98
SW5_GPIO
  Top 0.406: S5.3 113.73,74.08 R5.2 110.49,72.81 110.49,48.26 106.68,44.45 88.9,44.45 86.92,42.47 86.92,27.23 83.82,24.13 58.42,24.13 RASPI.8
SW6_GPIO
  Top 0.406: S6.3 113.73,56.3 R6.2 113.03,49.53 106.68,43.18 88.9,43.18 88.9,22.86 83.82,19.05 62.23,19.05 59.69,21.59 RASPI.10
SW7_ADC  (via drill 0.6)
  Top 0.406: IC1.10 70.17,37.78 72.39,35.56 v82.55,35.56 | v107.95,36.83 R7.2
  Bottom 0.406: v82.55,35.56 102.87,35.56 104.14,36.83 v107.95,36.83 115.85,36.83 S7.3
VREF2.0  (via drill 0.6)
  Top 0.406: P1.3 33.63,33.02 48.26,33.02 49.53,31.75 49.53,30.48 54.61,30.48 55.84,31.71 P2.3 | 33.02,19.82 IC2.1 IC2.2 31.75,17.78 19.05,17.78 | 33.02,19.82 v33.02,24.13 | 19.05,17.78 16.51,20.32 16.51,21.59 17.78,22.86 R16.1 | R13.1 16.51,10.58 16.51,15.24 19.05,17.78 | P5.3 44.41,11.47 43.18,12.7 | 43.18,12.7 36.83,19.05 33.8,19.05 33.02,19.82 | 43.18,12.7 v55.88,12.7 | P4.3 106.87,32.37 S7.1
  Bottom 0.406: P1.3 28.55,27.94 26.67,27.94 25.4,26.67 25.4,25.4 26.67,24.13 v33.02,24.13 | v55.88,12.7 83.16,12.7 P4.3 | P3.3 79.97,41.87 81.28,43.18 83.82,43.18 86.36,40.64 91.44,40.64 95.25,44.45 113.31,44.45 S7.1